# Altium schematic sheet Power_Supply.SchDoc
size A3; SheetNumber: 2; SheetTotal: 25
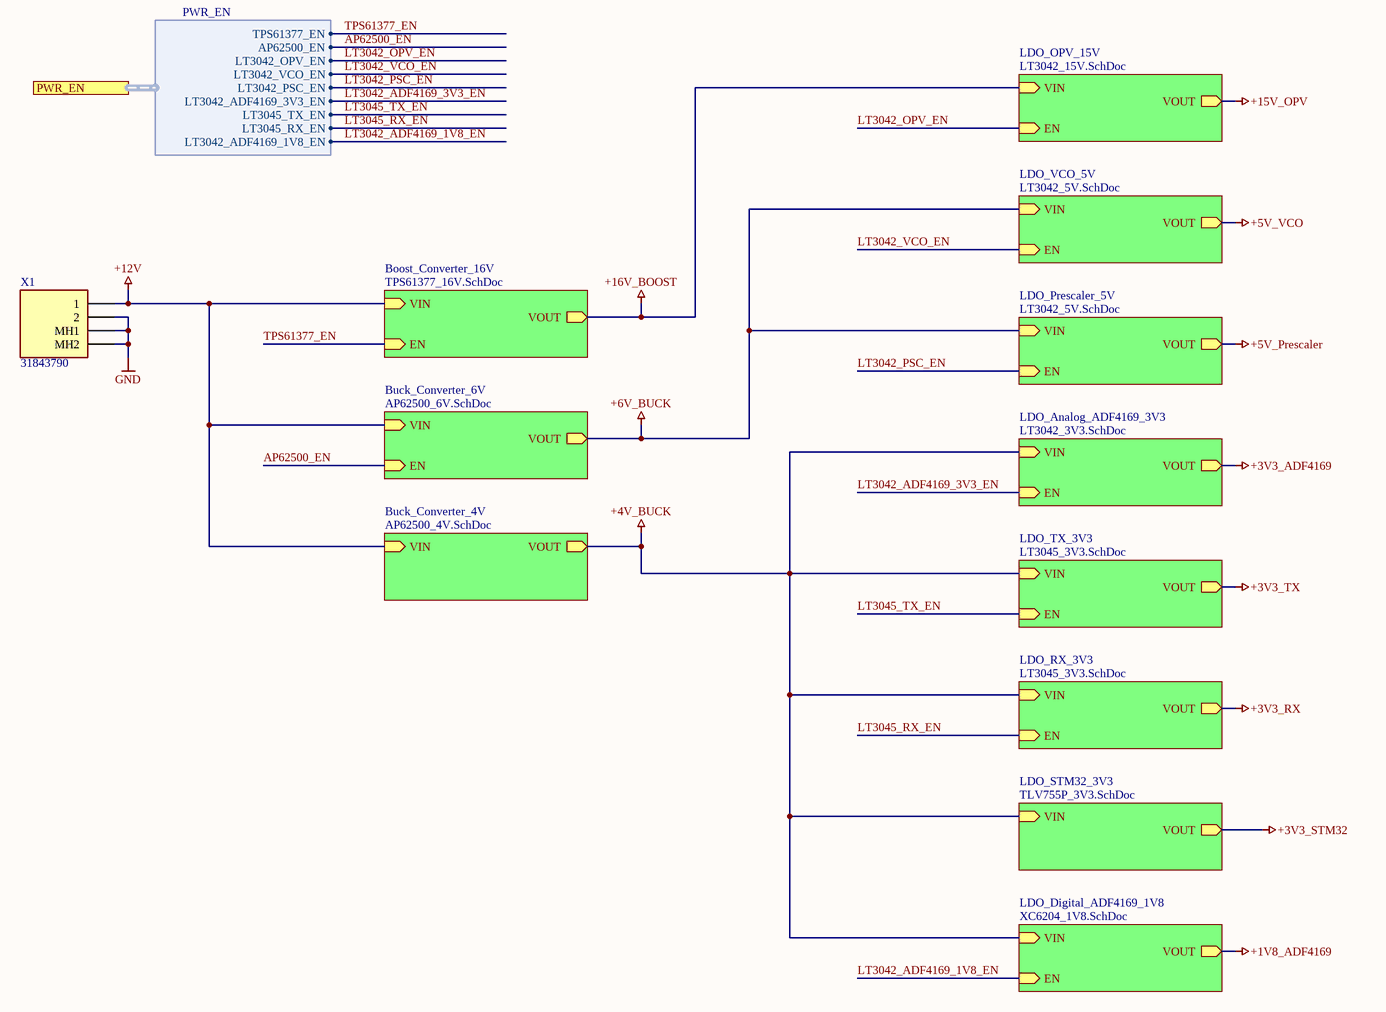
[diagram p0: Power_Supply.SchDoc]

## Parts
X1  31843790  [31843790]

## Sub-sheets
Boost_Converter_16V = TPS61377_16V.SchDoc: VIN (in), VOUT (out), EN (in)
Buck_Converter_4V = AP62500_4V.SchDoc: VIN (in), VOUT (out)
Buck_Converter_6V = AP62500_6V.SchDoc: VIN (in), VOUT (out), EN (in)
LDO_Analog_ADF4169_3V3 = LT3042_3V3.SchDoc: VIN (in), EN (in), VOUT (out)
LDO_Digital_ADF4169_1V8 = XC6204_1V8.SchDoc: VOUT (out), EN (in), VIN (in)
LDO_OPV_15V = LT3042_15V.SchDoc: VOUT (out), VIN (in), EN (in)
LDO_Prescaler_5V = LT3042_5V.SchDoc: VIN (in), EN (in), VOUT (out)
LDO_RX_3V3 = LT3045_3V3.SchDoc: VIN (in), EN (in), VOUT (out)
LDO_STM32_3V3 = TLV755P_3V3.SchDoc: VOUT (out), VIN (in)
LDO_TX_3V3 = LT3045_3V3.SchDoc: VOUT (out), EN (in), VIN (in)
LDO_VCO_5V = LT3042_5V.SchDoc: VIN (in), EN (in), VOUT (out)

## Ports
PWR_EN (harness PWR_EN, see Top_Level[3B], MCU[5B])

## Harnesses
PWR_EN: AP62500_EN, LT3042_OPV_EN, LT3042_VCO_EN, LT3042_PSC_EN, LT3042_ADF4169_3V3_EN, LT3045_TX_EN, TPS61377_EN, LT3042_ADF4169_1V8_EN, LT3045_RX_EN

## Nets
+1V8_ADF4169: sheet LDO_Digital_ADF4169_1V8/VOUT
+3V3_ADF4169: sheet LDO_Analog_ADF4169_3V3/VOUT
+3V3_RX: sheet LDO_RX_3V3/VOUT
+3V3_STM32: sheet LDO_STM32_3V3/VOUT
+3V3_TX: sheet LDO_TX_3V3/VOUT
+4V_BUCK: sheet LDO_Analog_ADF4169_3V3/VIN, sheet LDO_TX_3V3/VIN, sheet LDO_Digital_ADF4169_1V8/VIN, sheet Buck_Converter_4V/VOUT, sheet LDO_STM32_3V3/VIN, sheet LDO_RX_3V3/VIN
+5V_Prescaler: sheet LDO_Prescaler_5V/VOUT
+5V_VCO: sheet LDO_VCO_5V/VOUT
+6V_BUCK: sheet LDO_VCO_5V/VIN, sheet LDO_Prescaler_5V/VIN, sheet Buck_Converter_6V/VOUT
+12V: X1.1 ; sheet Boost_Converter_16V/VIN, sheet Buck_Converter_4V/VIN, sheet Buck_Converter_6V/VIN
+15V_OPV: sheet LDO_OPV_15V/VOUT
+16V_BOOST: sheet Boost_Converter_16V/VOUT, sheet LDO_OPV_15V/VIN
GND: X1.2 X1.MH1 X1.MH2
AP62500_EN: sheet Buck_Converter_6V/EN, port PWR_EN.AP62500_EN
LT3042_ADF4169_1V8_EN: sheet LDO_Digital_ADF4169_1V8/EN, port PWR_EN.LT3042_ADF4169_1V8_EN
LT3042_ADF4169_3V3_EN: sheet LDO_Analog_ADF4169_3V3/EN, port PWR_EN.LT3042_ADF4169_3V3_EN
LT3042_OPV_EN: sheet LDO_OPV_15V/EN, port PWR_EN.LT3042_OPV_EN
LT3042_PSC_EN: sheet LDO_Prescaler_5V/EN, port PWR_EN.LT3042_PSC_EN
LT3042_VCO_EN: sheet LDO_VCO_5V/EN, port PWR_EN.LT3042_VCO_EN
LT3045_RX_EN: sheet LDO_RX_3V3/EN, port PWR_EN.LT3045_RX_EN
LT3045_TX_EN: sheet LDO_TX_3V3/EN, port PWR_EN.LT3045_TX_EN
TPS61377_EN: sheet Boost_Converter_16V/EN, port PWR_EN.TPS61377_EN

## Library data of the parts
X1 = X000004: Manufacturer: Phoenix Contact; ID: X000004; Type: Phoenix Board Connector; Manufacturer Part Number: 31843790; Part Value: 31843790; Case: 31843790; ComponentLink1Description: Datasheet; ComponentLink1URL: https://www.phoenixcontact.com/en-us/products/pcb-header-mc-15-2-gf-35-1843790?type=pdf; Supplier 1: Mouser; Supplier Part Number 1: 651-1843790; Supplier 2: Digikey; Supplier Part Number 2: 277-5882-ND